# Altium schematic sheet Misc.SchDoc
size A3; SheetNumber: 6; SheetTotal: 6
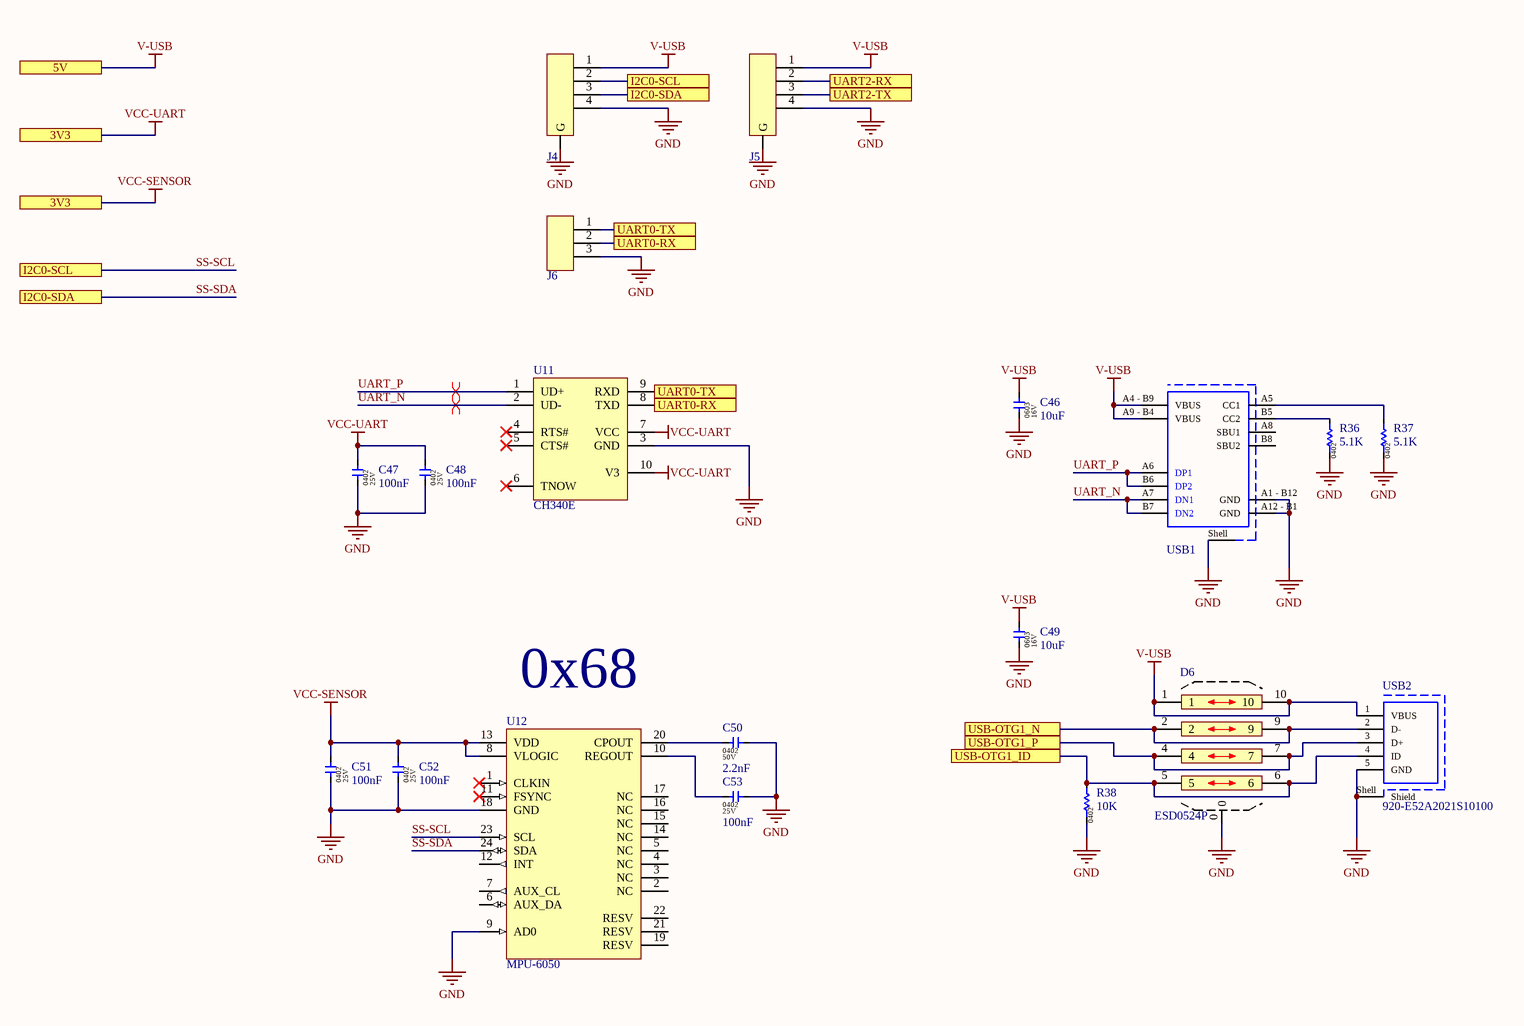
[diagram p0: Misc.SchDoc]

## Parts
C46  10uF  [CAP-0603]
C47  100nF  [CAP-0402]
C48  100nF  [CAP-0402]
C49  10uF  [CAP-0603]
C50  2.2nF  [CAP-0402]
C51  100nF  [CAP-0402]
C52  100nF  [CAP-0402]
C53  100nF  [CAP-0402]
D6  ESD0524P  [DFN2510]
J4  1.25T-4P-WT  [Conn MX1.25 (4)]  (value not drawn)
J5  1.25T-4P-WT  [Conn MX1.25 (4)]  (value not drawn)
J6  PZ254V-11-03P  [Conn 3P-2.54H]  (value not drawn)
R36  5.1K  [RES-0402]
R37  5.1K  [RES-0402]
R38  10K  [RES-0402]
U11  CH340E  [MSOP-10]
U12  MPU-6050  [QFN24-4x4MM_PAD]
USB1  918-418K2023S40001  [1 FEMALE USB -C 16]  (value not drawn)
USB2  920-E52A2021S10100  [Micro USB - type 2]

## Ports
3V3, 5V, I2C0-SCL, I2C0-SDA, UART0-RX, UART0-TX, UART2-RX, UART2-TX, USB-OTG1_ID, USB-OTG1_N, USB-OTG1_P

## Nets
GND: C46.1 C47.1 C48.1 C49.1 C50.2 C51.1 C52.1 C53.2 D6.0 J4.0(G) J4.4 J5.0(G) J5.4 J6.3 R36.1 R37.1 R38.1 U11.3(GND) U12.9(AD0) U12.18(GND) USB1.A1_-_B12(GND) USB1.A12_-_B1(GND) USB1.Shell(Shield) USB2.5(GND) USB2.Shell(Shield)
V-USB: C46.2 C49.2 D6.1 D6.10 J4.1 J5.1 USB1.A4_-_B9(VBUS) USB1.A9_-_B4(VBUS) USB2.1(VBUS) ; port 5V
VCC-SENSOR: C47.2 C48.2 C51.2 C52.2 U11.7(VCC) U11.10(V3) U12.8(VLOGIC) U12.13(VDD) ; port 3V3  [also labelled VCC-UART]
SS-SCL: J4.2 U12.23(SCL) ; port I2C0-SCL
SS-SDA: J4.3 U12.24(SDA) ; port I2C0-SDA
UART0-RX: J6.2 U11.8(TXD) ; port UART0-RX
UART0-TX: J6.1 U11.9(RXD) ; port UART0-TX
UART2-RX: J5.2 ; port UART2-RX
UART2-TX: J5.3 ; port UART2-TX
UART_N: U11.2(UD-) USB1.A7(DN1) USB1.B7(DN2)
UART_P: U11.1(UD+) USB1.A6(DP1) USB1.B6(DP2)
USB-OTG1_ID: D6.5 D6.6 R38.2 USB2.4(ID) ; port USB-OTG1_ID
USB-OTG1_N: D6.2 D6.9 USB2.2(D-) ; port USB-OTG1_N
USB-OTG1_P: D6.4 D6.7 USB2.3(D+) ; port USB-OTG1_P
NetC50_1: C50.1 U12.20(CPOUT)
NetC53_1: C53.1 U12.10(REGOUT)
NetR36_2: R36.2 USB1.B5(CC2)
NetR37_2: R37.2 USB1.A5(CC1)

Not connected (* = marked no-connect by the designer): U11 4(RTS#)* 5(CTS#)* 6(TNOW)*; U12 1(CLKIN)* 2(NC) 3(NC) 4(NC) 5(NC) 6(AUX_DA) 7(AUX_CL) 11(FSYNC)* 12(INT) 14(NC) 15(NC) 16(NC) 17(NC) 19(RESV) 21(RESV) 22(RESV); USB1 A8(SBU1) B8(SBU2)

## Layout directives
differential pair; differential pair class DIFF90_USB: UART_N, UART_P

## Notes on the sheet
- (near U12) 0x68

## Library data of the parts
C46 C49 = 0603X106M160CT: 16V 10uF X5R ±20% 0603 Multilayer Ceramic Capacitors MLCC - SMD/SMT ROHS; Manufacture: WALSIN; Package / Case: 0402; Component type: Capacitor; Manufacture part: 0603X106M160CT; Capacitor value: 10uF; Voltage: 16V; Package: 0603
C47 C48 C51-C53 = 0402X104K250CT: 100nF ±10% 25V X5R 0402 Multilayer Ceramic Capacitors MLCC - SMD/SMT RoHS; Manufacture: WALSIN; Package / Case: 0402; Component type: Capacitor; Manufacture part: 0402X104K250CT; Capacitor value: 100nF; Voltage: 25V; Package: 0402
C50 = 0402B222K500CT: 50V 2.2nF X7R ±10% 0402 Multilayer Ceramic Capacitors MLCC - SMD/SMT ROHS; Manufacture: WALSIN; Package / Case: 0402; Component type: Capacitor; Manufacture part: 0402B222K500CT; Capacitor value: 2.2nF; Voltage: 50V; Package: 0402
D6 = ESD0524P: DFN2510 ESD Protection Devices ROHS; Manufacture: MDD（Microdiode Electronics）; Type: TVS/ESD Bi diode; Diode value: 5V; Manufacture part: ESD0524P; Package: DFN2510; Datasheet: https://datasheet.lcsc.com/lcsc/2009281808_MDD-Microdiode-Electronics--ESD0524P_C840786.pdf
J4 J5 = 1.25T-4P-WT: MX1.25 Header Male Pin 0.049"(1.25mm) 4 SMD,P=1.25mm Wire To Board / Wire To Wire Connector RoHS; Manufacture: Korean Hroparts Elec; Manufacture part: 1.25T-4P-WT; Type: MX1.25; Datasheet: https://datasheet.lcsc.com/lcsc/1903211730_Korean-Hroparts-Elec-1-25T-4P-WT_C125739.pdf
J6 = PZ254V-11-03P: Pin Header 3 1 Straight，180degrees 2.54mm Through Hole,P=2.54mm Pin Header & Female Header RoHS; Manufacture: XFCN; Manufacture part: PZ254V-11-03P; Type: Pin Header; Datasheet: https://datasheet.lcsc.com/lcsc/2003141409_XFCN-PZ254V-11-02P_C492401.pdf
R36 R37 = WR04X5101FTL: 5.1kΩ ±1% 1/16W ±100ppm/℃ 0402 Chip Resistor - Surface Mount RoHS; Manufacture: WALSIN; Package / Case: 0201; Component type: Resistor; Manufacture part: WR04X5101FTL; Resistor value: 5.1K; Package: 0402
R38 = WR04X1002FTL: 10kΩ ±1% 1/16W ±100ppm/℃ 0402 Chip Resistor - Surface Mount RoHS; Manufacture: WALSIN; Package / Case: 0201; Component type: Resistor; Manufacture part: WR04X1002FTL; Resistor value: 10K; Package: 0402
U11 = CH340E: Transceiver USB 2.0 2Mbps MSOP-10 USB ICs RoHS; Manufacture: WCH; Manufacture part: CH340E; Package: MSOP-10; Datasheet: https://datasheet.lcsc.com/lcsc/2008191806_WCH-Jiangsu-Qin-Heng-CH340E_C99652.pdf
U12 = MPU-6050: 6-axis accelerometer/gyroscope; Manufacture: TDK InvenSense; Manufacture part: MPU-6050; Package: QFN-24 (4x4); Datasheet: https://datasheet.lcsc.com/lcsc/1811071024_TDK-InvenSense-MPU-6050_C24112.pdf
USB1 = 918-418K2023S40001: USB - Type C Female 16 SMD USB Connectors RoHS; Manufacture: Jing Extension of the Electronic Co.; Manufacture part: 918-418K2023S40001; Type: USB-C; Datasheet: https://datasheet.lcsc.com/lcsc/2103051833_Jing-Extension-of-the-Electronic-Co-918-418K2023S40001_C167321.pdf
USB2 = 920-E52A2021S10100: USB - Micro B Female USB 2 USB Connectors RoHS; Manufacture: Jing Extension of the Electronic Co.; Manufacture part: 920-E52A2021S10100; Type: USB-Micro B; Datasheet: https://datasheet.lcsc.com/lcsc/2103051832_Jing-Extension-of-the-Electronic-Co-920-E52A2021S10100_C10418.pdf